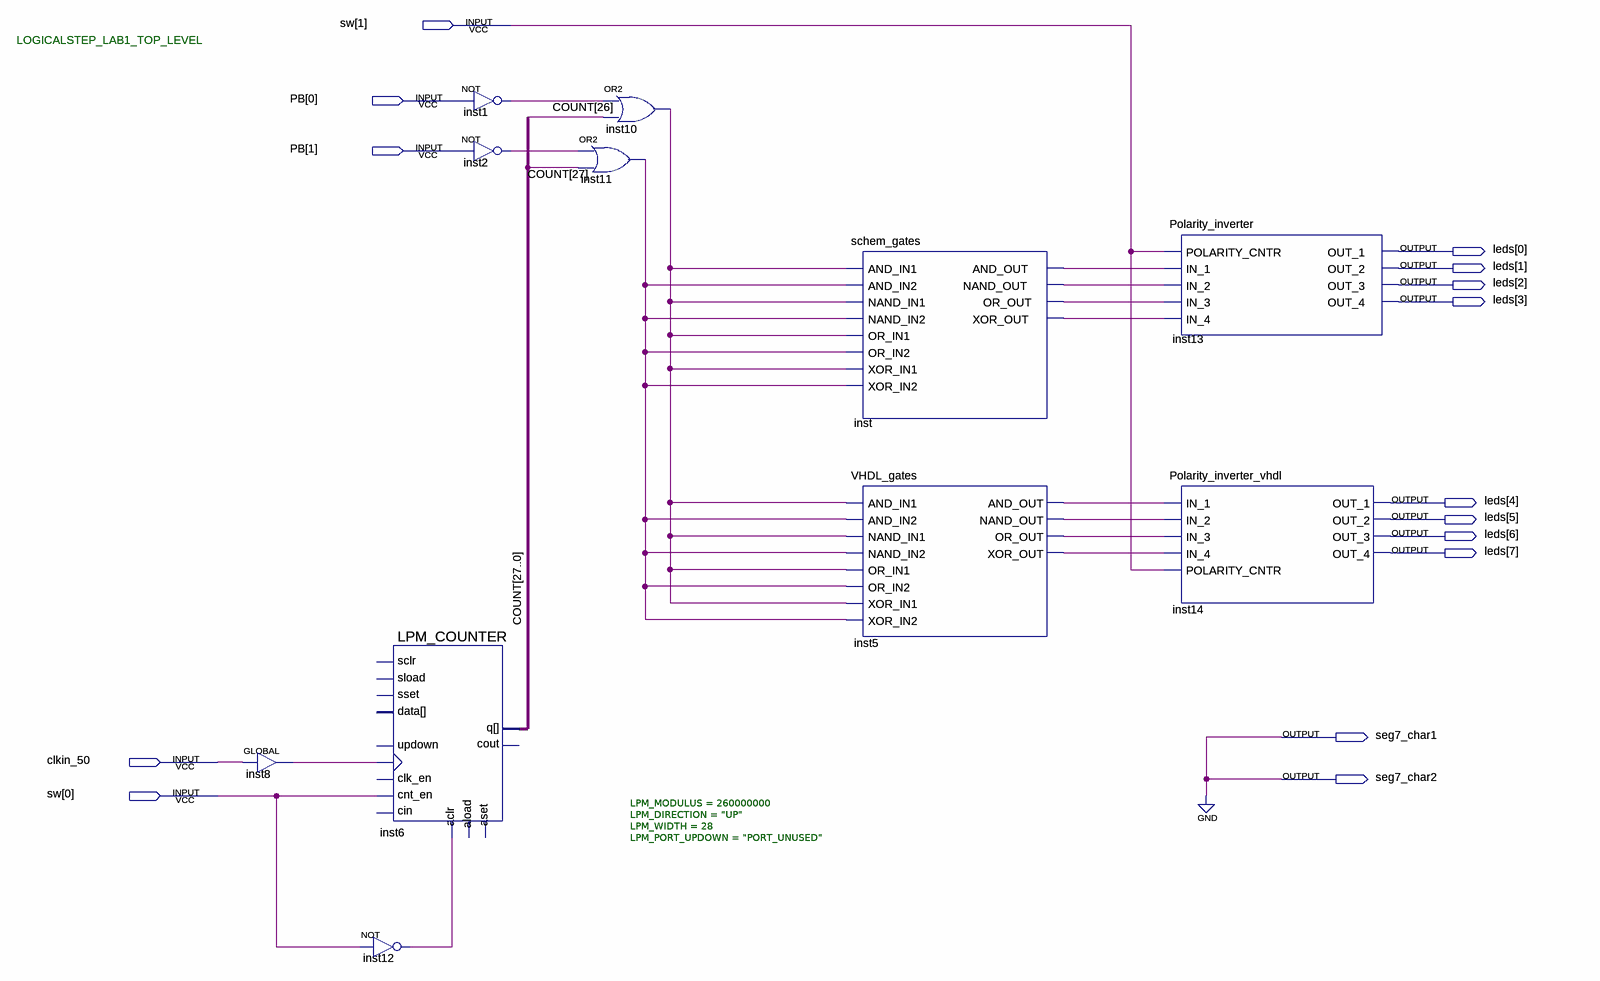
[diagram p0: schematic sheet]
// Quartus schematic LogicalStep_Lab1_top.bdf as structural Verilog: 22 symbols, 30 pins
module LogicalStep_Lab1_top (
  input  [1:0] sw,
  input  [1:0] PB,
  input  clkin_50,
  output [7:0] leds,
  output seg7_char1,
  output seg7_char2
);

  wire inst1_out, inst2_out, inst5_and_out, inst5_nand_out, inst5_or_out, inst5_xor_out, inst6_cout,
       inst8_out, inst10_out, inst11_out, inst12_out, inst_and_out, inst_nand_out, inst_or_out, inst_xor_out,
       undriven, undriven_2, undriven_3, undriven_5, undriven_6, undriven_7, undriven_8, undriven_9;
  wire [27:0] COUNT, undriven_4;

  GLOBAL inst8 (.IN(clkin_50), .OUT(inst8_out));
  GLOBAL inst8_dup2 (.IN(clkin_50), .OUT(inst8_out));
  LPM_COUNTER #(.LPM_MODULUS(260000000), .LPM_DIRECTION("UP"), .LPM_WIDTH(28), .LPM_PORT_UPDOWN("PORT_UNUSED")) inst6 (
    .sload(undriven_2), .data(undriven_4), .clock(inst8_out), .clk_en(undriven_6), .aload(undriven_8),
    .aclr(inst12_out), .aset(undriven_9), .cin(undriven_7), .sset(undriven_3), .updown(undriven_5),
    .cnt_en(sw[0]), .sclr(undriven), .q(COUNT), .cout(inst6_cout));
  LPM_COUNTER #(.LPM_MODULUS(260000000), .LPM_DIRECTION("UP"), .LPM_WIDTH(28), .LPM_PORT_UPDOWN("PORT_UNUSED")) inst6_dup2 (
    .sload(undriven_2), .data(undriven_4), .clock(inst8_out), .clk_en(undriven_6), .aload(undriven_8),
    .aclr(inst12_out), .aset(undriven_9), .cin(undriven_7), .sset(undriven_3), .updown(undriven_5),
    .cnt_en(sw[0]), .sclr(undriven), .q(COUNT), .cout(inst6_cout));
  not inst12 (inst12_out, sw[0]);
  not inst12_dup2 (inst12_out, sw[0]);
  not inst1 (inst1_out, PB[0]);
  not inst1_dup2 (inst1_out, PB[0]);
  not inst2 (inst2_out, PB[1]);
  not inst2_dup2 (inst2_out, PB[1]);
  or inst10 (inst10_out, inst1_out, COUNT[26]);
  or inst10_dup2 (inst10_out, inst1_out, COUNT[26]);
  or inst11 (inst11_out, inst2_out, COUNT[27]);
  or inst11_dup2 (inst11_out, inst2_out, COUNT[27]);
  schem_gates inst (
    .AND_IN1(inst10_out), .AND_IN2(inst11_out), .NAND_IN1(inst10_out), .NAND_IN2(inst11_out),
    .OR_IN1(inst10_out), .OR_IN2(inst11_out), .XOR_IN1(inst10_out), .XOR_IN2(inst11_out),
    .AND_OUT(inst_and_out), .NAND_OUT(inst_nand_out), .OR_OUT(inst_or_out), .XOR_OUT(inst_xor_out));
  schem_gates inst_dup2 (
    .AND_IN1(inst10_out), .AND_IN2(inst11_out), .NAND_IN1(inst10_out), .NAND_IN2(inst11_out),
    .OR_IN1(inst10_out), .OR_IN2(inst11_out), .XOR_IN1(inst10_out), .XOR_IN2(inst11_out),
    .AND_OUT(inst_and_out), .NAND_OUT(inst_nand_out), .OR_OUT(inst_or_out), .XOR_OUT(inst_xor_out));
  VHDL_gates inst5 (
    .AND_IN1(inst10_out), .AND_IN2(inst11_out), .NAND_IN1(inst10_out), .NAND_IN2(inst11_out),
    .OR_IN1(inst10_out), .OR_IN2(inst11_out), .XOR_IN1(inst10_out), .XOR_IN2(inst11_out),
    .AND_OUT(inst5_and_out), .NAND_OUT(inst5_nand_out), .OR_OUT(inst5_or_out), .XOR_OUT(inst5_xor_out));
  VHDL_gates inst5_dup2 (
    .AND_IN1(inst10_out), .AND_IN2(inst11_out), .NAND_IN1(inst10_out), .NAND_IN2(inst11_out),
    .OR_IN1(inst10_out), .OR_IN2(inst11_out), .XOR_IN1(inst10_out), .XOR_IN2(inst11_out),
    .AND_OUT(inst5_and_out), .NAND_OUT(inst5_nand_out), .OR_OUT(inst5_or_out), .XOR_OUT(inst5_xor_out));
  Polarity_inverter inst13 (
    .POLARITY_CNTR(sw[1]), .IN_1(inst_and_out), .IN_2(inst_nand_out), .IN_3(inst_or_out),
    .IN_4(inst_xor_out), .OUT_1(leds[0]), .OUT_2(leds[1]), .OUT_3(leds[2]), .OUT_4(leds[3]));
  Polarity_inverter inst13_dup2 (
    .POLARITY_CNTR(sw[1]), .IN_1(inst_and_out), .IN_2(inst_nand_out), .IN_3(inst_or_out),
    .IN_4(inst_xor_out), .OUT_1(leds[0]), .OUT_2(leds[1]), .OUT_3(leds[2]), .OUT_4(leds[3]));
  Polarity_inverter_vhdl inst14 (
    .IN_1(inst5_and_out), .IN_2(inst5_nand_out), .IN_3(inst5_or_out), .IN_4(inst5_xor_out),
    .POLARITY_CNTR(sw[1]), .OUT_1(leds[4]), .OUT_2(leds[5]), .OUT_3(leds[6]), .OUT_4(leds[7]));
  Polarity_inverter_vhdl inst14_dup2 (
    .IN_1(inst5_and_out), .IN_2(inst5_nand_out), .IN_3(inst5_or_out), .IN_4(inst5_xor_out),
    .POLARITY_CNTR(sw[1]), .OUT_1(leds[4]), .OUT_2(leds[5]), .OUT_3(leds[6]), .OUT_4(leds[7]));

  assign seg7_char1 = 1'b0;
  assign seg7_char2 = 1'b0;

  // Notes on the sheet:
  //   LOGICALSTEP_LAB1_TOP_LEVEL
  //   LOGICALSTEP_LAB1_TOP_LEVEL
endmodule
